# EAGLE design Eagle_BluetoothProtoboardAdapter (EAGLE 6.4)
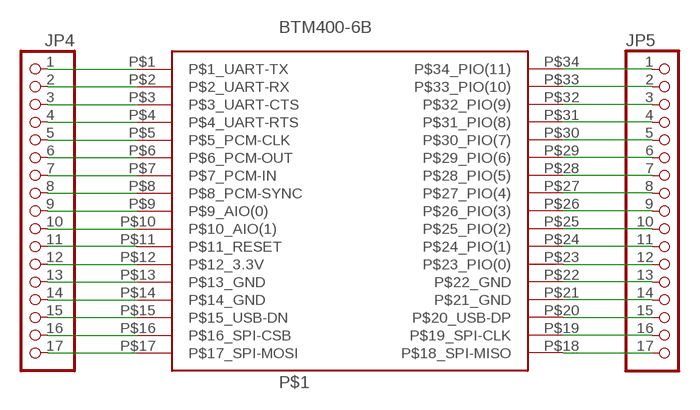
[diagram p0: schematic, sheet 1]

## Parts
JP4  PINHD-1X17  [1X17]
JP5  PINHD-1X17  [1X17]
P$1  BTM400-6B  [BTM400]

## Nets
N$1: JP4.1 P$1.P$1(P$1_UART-TX)
N$2: JP4.2 P$1.P$2(P$2_UART-RX)
N$3: JP4.3 P$1.P$3(P$3_UART-CTS)
N$4: JP4.4 P$1.P$4(P$4_UART-RTS)
N$5: JP4.5 P$1.P$5(P$5_PCM-CLK)
N$6: JP4.6 P$1.P$6(P$6_PCM-OUT)
N$7: JP4.7 P$1.P$7(P$7_PCM-IN)
N$8: JP4.8 P$1.P$8(P$8_PCM-SYNC)
N$9: JP4.9 P$1.P$9(P$9_AIO(0))
N$10: JP4.10 P$1.P$10(P$10_AIO(1))
N$11: JP4.11 P$1.P$11(P$11_RESET)
N$12: JP4.12 P$1.P$12(P$12_3.3V)
N$13: JP4.15 P$1.P$15(P$15_USB-DN)
N$14: JP4.16 P$1.P$16(P$16_SPI-CSB)
N$15: JP5.17 P$1.P$18(P$18_SPI-MISO)
N$16: JP5.13 P$1.P$22(P$22_GND)
N$17: JP4.17 P$1.P$17(P$17_SPI-MOSI)
N$18: JP5.1 P$1.P$34(P$34_PIO(11))
N$19: JP5.2 P$1.P$33(P$33_PIO(10))
N$20: JP5.3 P$1.P$32(P$32_PIO(9))
N$21: JP5.4 P$1.P$31(P$31_PIO(8))
N$22: JP5.5 P$1.P$30(P$30_PIO(7))
N$23: JP5.6 P$1.P$29(P$29_PIO(6))
N$24: JP5.7 P$1.P$28(P$28_PIO(5))
N$25: JP5.8 P$1.P$27(P$27_PIO(4))
N$26: JP5.9 P$1.P$26(P$26_PIO(3))
N$27: JP5.10 P$1.P$25(P$25_PIO(2))
N$28: JP5.12 P$1.P$23(P$23_PIO(0))
N$29: JP5.14 P$1.P$21(P$21_GND)
N$30: JP5.15 P$1.P$20(P$20_USB-DP)
N$31: JP5.16 P$1.P$19(P$19_SPI-CLK)
N$32: JP5.11 P$1.P$24(P$24_PIO(1))
N$35: JP4.13 P$1.P$13(P$13_GND)
N$36: JP4.14 P$1.P$14(P$14_GND)

## Library data of the parts
JP4 JP5 = pinhead:PINHD-1X17: PIN HEADER
P$1 = btm400-6b:BTM400-6B: BTM400 6B Bluetooth Module 13mm x 26.9mm 34 pins

## Net classes
0 default: width 0.254 mm, drill 0.254 mm, clearance 0.406 mm

## Board
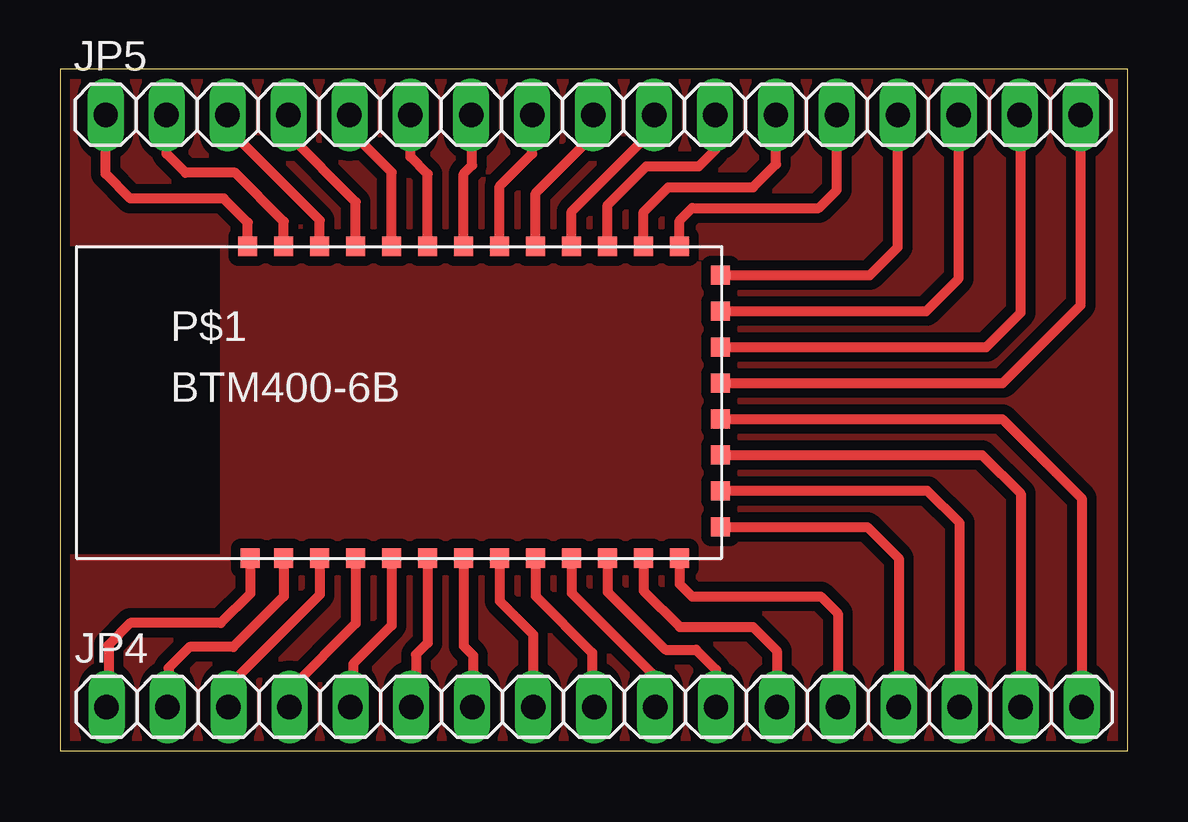
[diagram p1: board, top side]

Size 44.52 x 28.41 mm. Coordinates in mm from the lower left corner, seen from the top.
Outline: 0,0 44.52,0 44.52,28.41 0,28.41 0,0
Copper layers (1*16): Top 0.035mm / dielectric 1.5mm / Bottom 0.035mm
Design rules "dirt_cheap_dirty_boards.v1": minimum track width 5mil, minimum drill 12mil, track to track 5mil, track to pad 5mil, pad to pad 5mil, via to via 5mil, smd to smd 0mil, copper to edge 10mil, drill to drill 10mil, minimum pad ring 10mil, minimum via ring 6mil, stop-mask expansion 2mil, vias tented up to drill 25mil, thermal gap 10mil

### Footprints (pad centres in the part's own frame; a part is rotated, then mirrored left to right if it is on the bottom)
1X17 = drill 1.016 long: 1 -20.32,0; 2 -17.78,0; 3 -15.24,0; 4 -12.7,0; 5 -10.16,0; 6 -7.62,0; 7 -5.08,0; 8 -2.54,0; 9 0,0; 10 2.54,0; 11 5.08,0; 12 7.62,0; 13 10.16,0; 14 12.7,0; 15 15.24,0; 16 17.78,0; 17 20.32,0
BTM400 = smd 0.8 x 0.8: P$1 -6.2,-6.5; P$2 -4.8,-6.5; P$3 -3.3,-6.5; P$4 -1.8,-6.5; P$5 -0.3,-6.5; P$6 1.2,-6.5; P$7 2.7,-6.5; P$8 4.2,-6.5; P$9 5.7,-6.5; P$10 7.2,-6.5; P$11 8.7,-6.5; P$12 10.2,-6.5; P$13 11.7,-6.5; P$14 13.4,-5.2; P$15 13.4,-3.7; P$16 13.4,-2.2; P$17 13.4,-0.7; P$18 13.4,0.8; P$19 13.4,2.3; P$20 13.4,3.8; P$21 13.4,5.3; P$22 11.7,6.5; P$23 10.2,6.5; P$24 8.7,6.5; P$25 7.2,6.5; P$26 5.7,6.5; P$27 4.2,6.5; P$28 2.7,6.5; P$29 1.2,6.5; P$30 -0.3,6.5; P$31 -1.8,6.5; P$32 -3.3,6.5; P$33 -4.8,6.5; P$34 -6.3,6.5

### Placement (x,y rotation side)
JP4  22.26,1.83 0 top
JP5  22.23,26.51 0 top
P$1  14.13,14.53 0 top

### Tracks (layer width: path | path; a pad name or v marks a point on that pad's centre or on a via)
N$1
  Top 0.406: P$1.P$1 7.93,6.54 6.71,5.32 2.94,5.32 2.02,4.41 2.02,1.91 JP4.1
N$2
  Top 0.406: P$1.P$2 9.33,6.43 7.22,4.33 5.4,4.33 4.52,3.45 4.52,1.86 JP4.2
N$3
  Top 0.406: P$1.P$3 10.83,6.5 7.06,2.74 7.06,1.86 JP4.3
N$4
  Top 0.406: P$1.P$4 12.33,5.3 9.6,2.58 9.6,1.86 JP4.4
N$5
  Top 0.406: P$1.P$5 13.83,5.22 12.22,3.61 12.22,1.95 JP4.5
N$6
  Top 0.406: P$1.P$6 15.33,4.49 14.84,4.01 14.84,2.02 JP4.6
N$7
  Top 0.406: P$1.P$7 16.83,4.36 17.22,3.97 17.22,1.86 JP4.7
N$8
  Top 0.406: P$1.P$8 18.33,6.24 19.73,4.84 JP4.8
N$9
  Top 0.406: P$1.P$9 19.83,6.44 22.18,4.09 22.18,1.91 JP4.9
N$10
  Top 0.406: P$1.P$10 21.33,6.57 24.8,3.1 JP4.10
N$11
  Top 0.406: P$1.P$11 22.83,6.62 25.24,4.21 26.51,4.21 27.34,3.37 JP4.11
N$12
  Top 0.406: P$1.P$12 24.33,6.67 25.84,5.16 28.89,5.16 29.89,4.17 JP4.12
N$13
  Top 0.406: JP4.15 37.51,9.48 36.16,10.84 32.62,10.84 P$1.P$15
N$14
  Top 0.406: P$1.P$16 38.44,12.33 40.05,10.72 JP4.16
N$15
  Top 0.406: P$1.P$18 39.3,15.33 42.55,18.57 JP5.17
N$16
  Top 0.406: P$1.P$22 25.83,22.1 26.35,22.62 31.63,22.62 32.38,23.38 JP5.13
N$17
  Top 0.406: P$1.P$17 39.28,13.83 42.59,10.52 JP4.17
N$18
  Top 0.406: P$1.P$34 7.83,22.02 6.83,23.02 2.94,23.02 1.91,24.05 JP5.1
N$19
  Top 0.406: P$1.P$33 9.33,22.06 7.3,24.09 5.24,24.09 4.45,24.88 JP5.2
N$20
  Top 0.406: P$1.P$32 10.83,22.11 6.99,25.96 JP5.3
N$21
  Top 0.406: P$1.P$31 12.33,22.87 9.53,25.68 JP5.4
N$22
  Top 0.406: P$1.P$30 13.83,24.11 12.06,25.88 JP5.5
N$23
  Top 0.406: P$1.P$29 15.33,24.04 14.61,24.77 JP5.6
N$24
  Top 0.406: P$1.P$28 16.83,24.05 17.18,24.41 17.18,26.47 JP5.7
N$25
  Top 0.406: P$1.P$27 18.33,23.53 19.68,24.88 JP5.8
N$26
  Top 0.406: P$1.P$26 19.83,23.24 22.23,25.64 JP5.9
N$27
  Top 0.406: P$1.P$25 21.33,22.48 24.77,25.92 JP5.10
N$28
  Top 0.406: P$1.P$23 24.33,22.46 25.36,23.5 28.89,23.5 29.84,24.45 JP5.12
N$29
  Top 0.406: P$1.P$21 33.76,19.83 34.92,21 JP5.14
N$30
  Top 0.406: P$1.P$20 36.11,18.33 37.47,19.68 JP5.15
N$31
  Top 0.406: P$1.P$19 38.61,16.83 40.05,18.26 40.05,26.47
  Top 0.61: 40.05,26.47 JP5.16
N$32
  Top 0.406: P$1.P$24 22.83,22.75 24.45,24.37 26.63,24.37 27.3,25.04 JP5.11
N$33
  pour Top (isolate 0.406): 0,0 44.49,0 44.49,28.42 0,28.42 0,21.15 6.79,21.15 6.79,8.06 0,8.06
N$35
  Top 0.406: P$1.P$13 25.83,6.95 26.35,6.43 31.71,6.43 32.42,5.71 JP4.13
N$36
  Top 0.406: P$1.P$14 33.66,9.33 34.97,8.02 JP4.14